# EAGLE schematic IIoT Schematic (EAGLE 9.1.0)
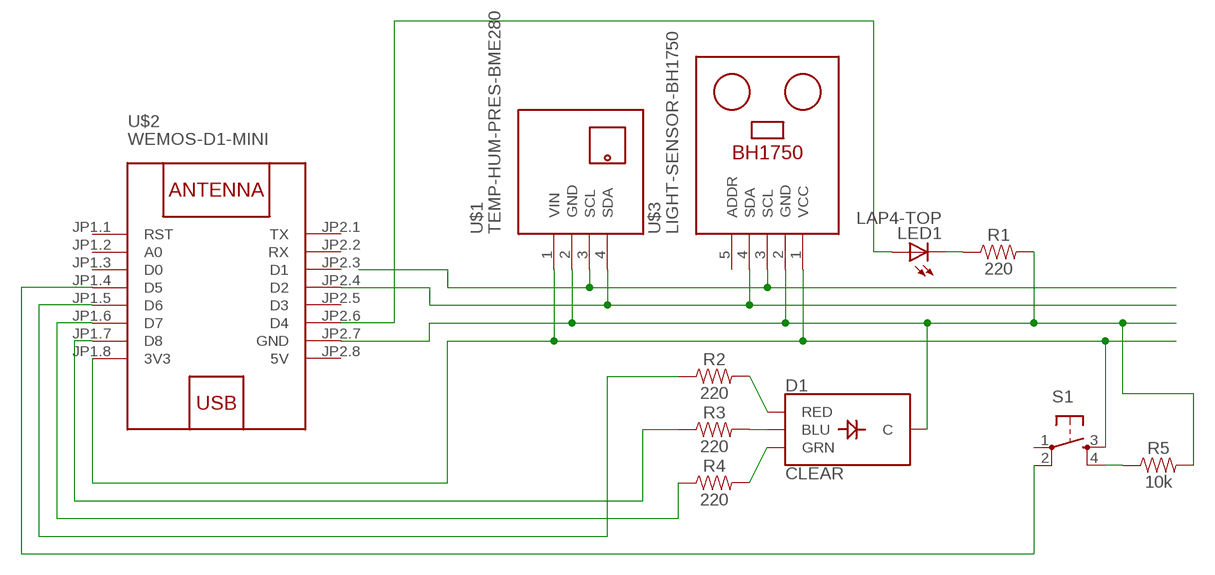
[diagram p0: schematic, sheet 1]

## Parts
D1  CLEAR  LED-RGB-CCCLEAR  [LED-RGB-THRU]
LED1  LAP4-TOP  [P47F-TOP]
R1  220  220OHM-0603-1/10W-1%  [0603]
R2  220  220OHM-0603-1/10W-1%  [0603]
R3  220  220OHM-0603-1/10W-1%  [0603]
R4  220  220OHM-0603-1/10W-1%  [0603]
R5  10k  10KOHM-HORIZ-1/4W-1%  [AXIAL-0.3]
S1  TAC_SWITCHPTH  [TACTILE-PTH]
U$1  TEMP-HUM-PRES-BME280  [TEMP-HUM-PRES-BME280]
U$2  WEMOS-D1-MINI  [WEMOS-D1-MINI]
U$3  LIGHT-SENSOR-BH1750  [LIGHT-SENSOR-BH1750]

## Nets
N$1: LED1.C R1.1
N$2: D1.1(RED) R2.2
N$3: D1.4(BLU) R3.2
N$4: D1.3(GRN) R4.2
N$5: S1.3 U$1.1(VIN) U$2.JP1.8(3V3) U$3.1(VCC)
N$6: D1.2(C) R1.2 R5.P$2 U$1.2(GND) U$2.JP2.7(GND) U$3.2(GND)
N$7: R5.P$1 S1.4
N$8: S1.2 U$2.JP1.4(D5)
N$9: LED1.A U$2.JP2.6(D4)
N$10: R3.1 U$2.JP1.7(D8)
N$11: U$1.4(SDA) U$2.JP2.4(D2) U$3.4(SDA)
N$12: U$1.3(SCL) U$3.3(SCL)
N$13: R2.1 U$2.JP1.5(D6)
N$14: R4.1 U$2.JP1.6(D7)
Unconnected: S1.1 U$2.JP1.1(RST) U$2.JP1.2(A0) U$2.JP1.3(D0) U$2.JP2.1(TX) U$2.JP2.2(RX) U$2.JP2.3(D1) U$2.JP2.5(D3) U$3.5(ADDR)

## Power pins joined to a net without a drawn wire
5V: U$2.JP2.8(5V)

## Library data of the parts
D1 = SparkFun-LED:LED-RGB-CC: LED-RGB Common Cathode Packages: LED RGB-THRU LED_PIRANHA_5MM SparkFun Products: RGB Diffused Common Cathode- Diffuse <[https://www.sparkfun.com/products/9264]> RGB Diffused Common Cathode - Clear <[https://www.sparkfun.com/products/105]> LED-RGB 5mm Square (Piranha) <[https://www.sparkfun.com/products/11679]>; PROD_ID: DIO-08418
LED1 = led:*P4: PointLED® Enhanced Thinfilm LED TOP & BOTTOM mount LS P47F, LR P47F, LA P47F, LY P47F, LT P4SG, LB P4SG, LW P4SG Source: http://catalog.osram-os.com .. LA_LR_LS_LY_P47F_Pb_free.pdf
R1-R4 = SparkFun-Resistors:220OHM: 220Ω resistor A resistor is a passive two-terminal electrical component that implements electrical resistance as a circuit element. Resistors act to reduce current flow, and, at the same time, act to lower voltage levels within circuits. - Wikipedia; PROD_ID: RES-07861
R5 = SparkFun-Resistors:10KOHM: 10kΩ resistor A resistor is a passive two-terminal electrical component that implements electrical resistance as a circuit element. Resistors act to reduce current flow, and, at the same time, act to lower voltage levels within circuits. - Wikipedia; PROD_ID: RES-12183
S1 = SparkFun-Retired:TAC_SWITCH: Momentary Switch Button commonly used for reset or general input. Spark Fun Electronics SKU : COM-00097 SMT- SWCH-08247
U$1 = diy-modules:TEMP-HUM-PRES-BME280: Digital Humidity-Temperature-Pressure Sensor based on BME280 device More information about BME280 device is available here: https://www.bosch-sensortec.com/bst/products/all_products/bme280 Click here to find device on ebay.com <http://www.ebay.com/sch/bme280+breakout>
U$2 = diy-modules:WEMOS-D1-MINI: WEMOS D1 mini: Mini Wi-Fi Board based on ESP-8266 device More details can be found here: https://www.wemos.cc/product/d1-mini.html Click here to find device on ebay.com <http://www.ebay.com/sch/wemos+d1+mini+nodemcu>
U$3 = diy-modules:LIGHT-SENSOR-BH1750: Digital Light Sensor based on BH1750 BH1750 datasheet is available here: http://www.mouser.com/ds/2/348/bh1750fvi-e-186247.pdf Arduino Library for BH1750 is available here: https://github.com/claws/BH1750 Video Tutorial is available here: https://www.youtube.com/watch?v=UsLcHSbxf_8 Click here to find device on ebay.com <http://www.ebay.com/sch/bh1750fvi+module> Note: There are many variants. Search for the proper version.